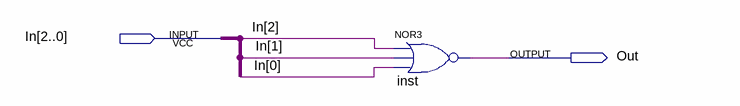
[diagram p0: schematic sheet]
// Quartus schematic nor3_bus.bdf as structural Verilog: 1 symbols, 2 pins
module nor3_bus (
  input  [2:0] In,
  output Out
);

  nor inst (Out, In[2], In[1], In[0]);
endmodule
